# Altium project PCB_Project.PrjPcb
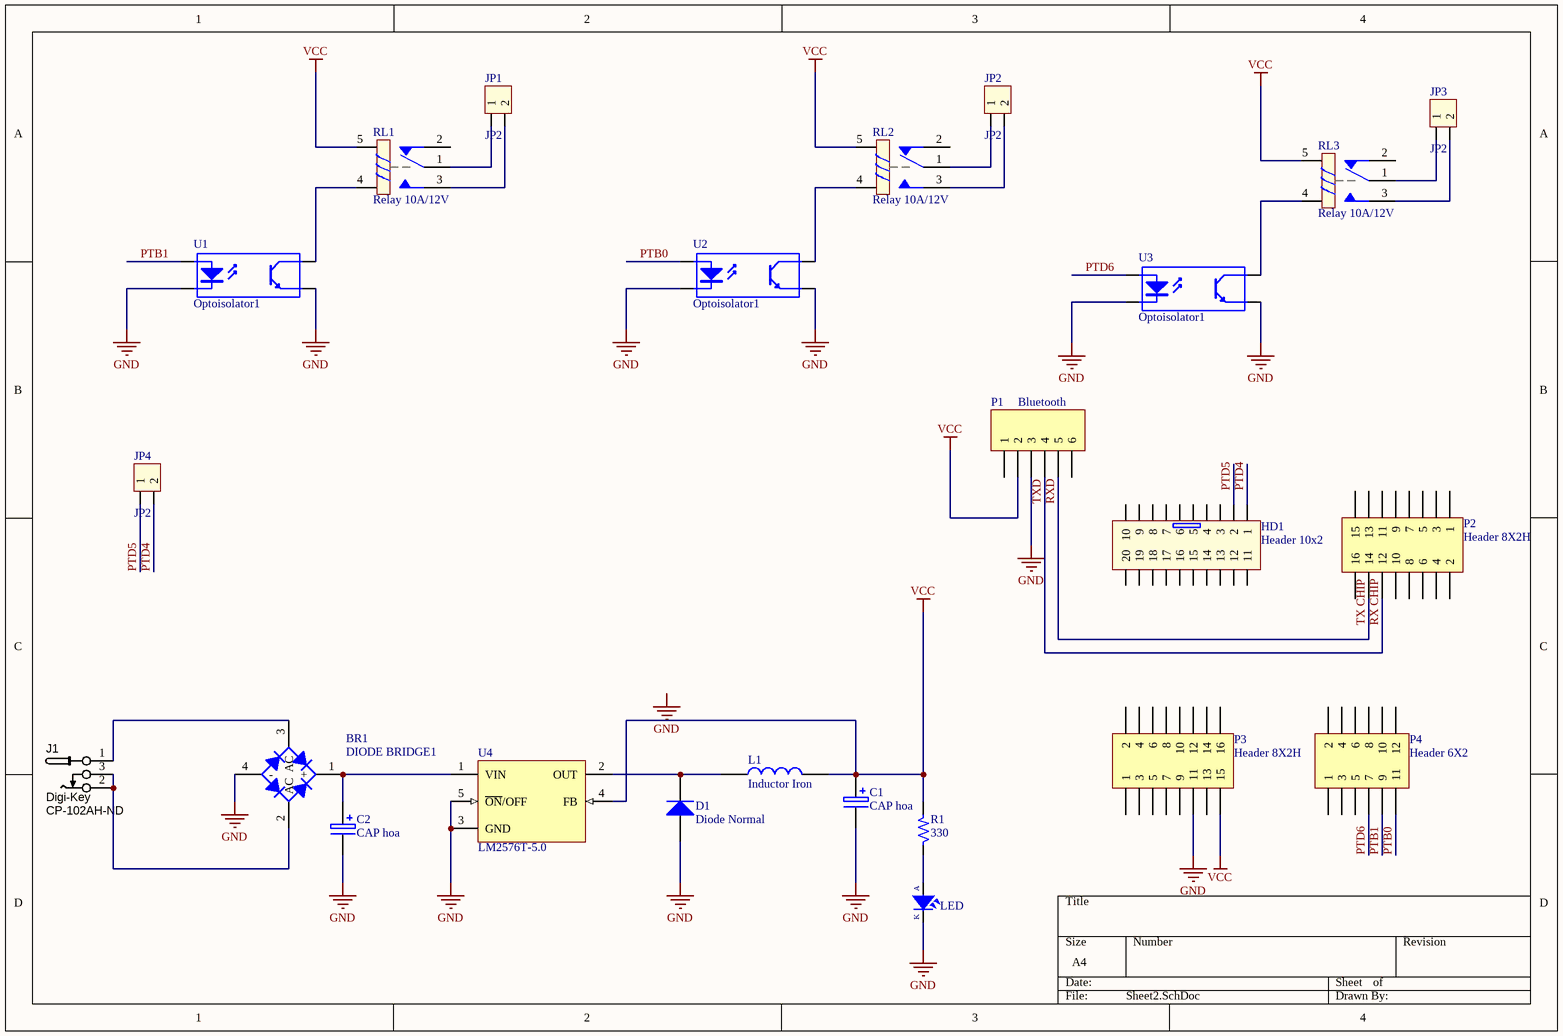
[diagram p0: Sheet2.SchDoc]
1 sheet, 24 parts. Net scope: global (net labels, ports and power ports of the same name join across sheets).
Board file: PCB1.PcbDoc

## Sheet Sheet2.SchDoc
size A4; SheetNumber: 1; SheetTotal: 1

### Parts
BR1  DIODE BRIDGE1  [CAU 1A]
C1  CAP hoa  [CP1.5/3.4]
C2  CAP hoa  [CP1.5/3.4]
D1  Diode Normal  [DIODE/NOM/0.5A]
HD1  Header 10x2  [Hed2X10]
J1  Supplier 1: Digi-Key  Supplier Part Number 1: CP-102AH-ND  [CONN_PWR_JACK_2.1x5.5mm]  (hidden comment: CONN_PWR_JACK_2.1x5.5mm)
JP1  JP2  [CON2]
JP2  JP2  [CON2]
JP3  JP2  [CON2]
JP4  JP2  [CON2]
L1  Inductor Iron  [PE-92102-100uH]
LED1  LED  [LED-3]
P1  Bluetooth  [HDR1X6]
P2  Header 8X2H  [HDR2X8H]
P3  Header 8X2H  [HDR2X8H]
P4  Header 6X2  [HDR2X6]
R1  330  [R1/4W]
RL1  Relay 10A/12V  [RL_SPDT_10A]
RL2  Relay 10A/12V  [RL_SPDT_10A]
RL3  Relay 10A/12V  [RL_SPDT_10A]
U1  Optoisolator1  [DIP-4]
U2  Optoisolator1  [DIP-4]
U3  Optoisolator1  [DIP-4]
U4  LM2576T-5.0  [LM2576t]

### Nets
GND: BR1.4(-) C1.2 C2.2 D1.1(A) LED1.2(K) P1.3 P3.11 U1.2(K) U1.3(E) U2.2(K) U2.3(E) U3.2(K) U3.3(E) U4.3(GND) U4.5(~{ON}/OFF)
VCC: C1.1 L1.2 P1.2 P3.15 R1.2 RL1.5 RL2.5 RL3.5 U4.4(FB)
PTB0: P4.11 U2.1(A)
PTB1: P4.9 U1.1(A)
PTD4: HD1.1 JP4.2
PTD5: HD1.2 JP4.1
PTD6: P4.7 U3.1(A)
RX CHIP: P1.4 P2.12  [also labelled TXD]
RXD: P1.5 P2.14  [also labelled TX CHIP]
NetBR1_1: BR1.1(+) C2.1 U4.1(VIN)
NetBR1_2: BR1.2(AC) J1.2 J1.3
NetBR1_3: BR1.3(AC) J1.1
NetD1_2: D1.2(K) L1.1 U4.2(OUT)
NetJP1_1: JP1.1 RL1.1
NetJP1_2: JP1.2 RL1.3
NetJP2_1: JP2.1 RL2.1
NetJP2_2: JP2.2 RL2.3
NetJP3_1: JP3.1 RL3.1
NetJP3_2: JP3.2 RL3.3
NetLED1_1: LED1.1(A) R1.1
NetRL1_4: RL1.4 U1.4(C)
NetRL2_4: RL2.4 U2.4(C)
NetRL3_4: RL3.4 U3.4(C)

Not connected (* = marked no-connect by the designer): HD1 3 4 5 6 7 8 9 10 11 12 13 14 15 16 17 18 19 20; P1 1 6; P2 1 2 3 4 5 6 7 8 9 10 11 13 15 16; P3 1 2 3 4 5 6 7 8 9 10 12 13 14 16; P4 1 2 3 4 5 6 8 10 12; RL1 2; RL2 2; RL3 2

### Notes on the sheet
- Labels drawn without touching a wire or pin: GND

### Library data of the parts
C1 C2 = CAP hoa: Cap
HD1 = HED10X2: Value: Header 5x2
J1 = CONN_PWR_JACK_2.1x5.5mm: Power Connector, THT, 2.1mm ID, 5.5mm OD; Manufacturer 1: CUI Inc; Manufacturer Part Number 1: PJ-102AH; SCDType: undef; Category: Connectors; Mounting Type: Through Hole; Package / Case: PCB mount; Value: 2.1mm ID, 5.5mm OD
JP1-JP4 = Con2: Connector 2; Value: Connector 2
L1 = Inductor Iron: Inductor
LED1 = LED: LED Single colour Green and Red; Value: LED 3 ly Single Colour
P1 = Header 6: Header, 6-Pin; LatestRevisionDate: 17-Jul-2002; LatestRevisionNote: Re-released for DXP Platform.; Publisher: Altium Limited
P2 P3 = Header 8X2H: Header, 8-Pin, Dual row, Right Angle; LatestRevisionDate: 17-Jul-2002; LatestRevisionNote: Re-released for DXP Platform.; Publisher: Altium Limited
P4 = Header 6X2: Header, 6-Pin, Dual row; LatestRevisionDate: 17-Jul-2002; LatestRevisionNote: Re-released for DXP Platform.; Publisher: Altium Limited
R1 = Res
RL1-RL3 = Relay 1: Relay SPDT,10A - 12VDC 5 Pin; Value: Relay SPDT, 10A, 12V
U1-U3 = Optoisolator1: 4-Pin Phototransistor Optocoupler; Published: 24-Mar-1999; LatestRevisionDate: 04-Mar-2005; LatestRevisionNote: Sch pins 3 & 4 Swapped.; DatasheetVersion: Nov-2003; PackageReference: DIP-4; Publisher: Altium Limited
U4 = LM2576T-5.0: SIMPLE SWITCHER; 3A Step-Down Voltage Regulator; Manufacturer: National Semiconductor; PackageTopMarking: NSUZXYTT*LM2576T*-5.0 P+; PowerWise: N; FirstPublished: 4-Dec-2008; DatasheetVersion: Aug-2004; PackageVersion: revJ, Jan-1992; PackageReference: T05A; Publisher: Altium Limited; PackageDescription: TO-220, Molded, 5 Lead, Straight; CompType: Switcher; PartNumber: LM2576T-5.0; RoHS: O; PinCount: 5; DigiKeyPartNumber: LM2576T-5.0-ND; Code_JEDEC: TO-220-AB; ComponentLink1Description: LM2576 Datasheet; ComponentLink1URL: http://www.national.com/ds/LM/LM2576.pdf; ComponentLink2Description: LM2576 Web Page; ComponentLink2URL: http://www.national.com/pf/LM/LM2576.html; ComponentLink3Description: T05A Package Page; ComponentLink3URL: http://www.national.com/packaging/folders/t05a.html
D1 = Diode Normal: Published: 8-Jun-2000; LatestRevisionDate: 17-Jul-2002; LatestRevisionNote: Re-released for DXP Platform.; DatasheetDocument: 1997; PackageReference: DO-35; Publisher: Altium Limited; Code_JEDEC: DO-204-AH; ComponentLink1Description: Manufacturer Link; ComponentLink1URL: http://www.fairchildsemi.com/; ComponentLink2Description: Datasheet; ComponentLink2URL: http://www.fairchildsemi.com/ds/1N%2F1N4448.pdf